# EAGLE design flea (EAGLE 9.6.2)
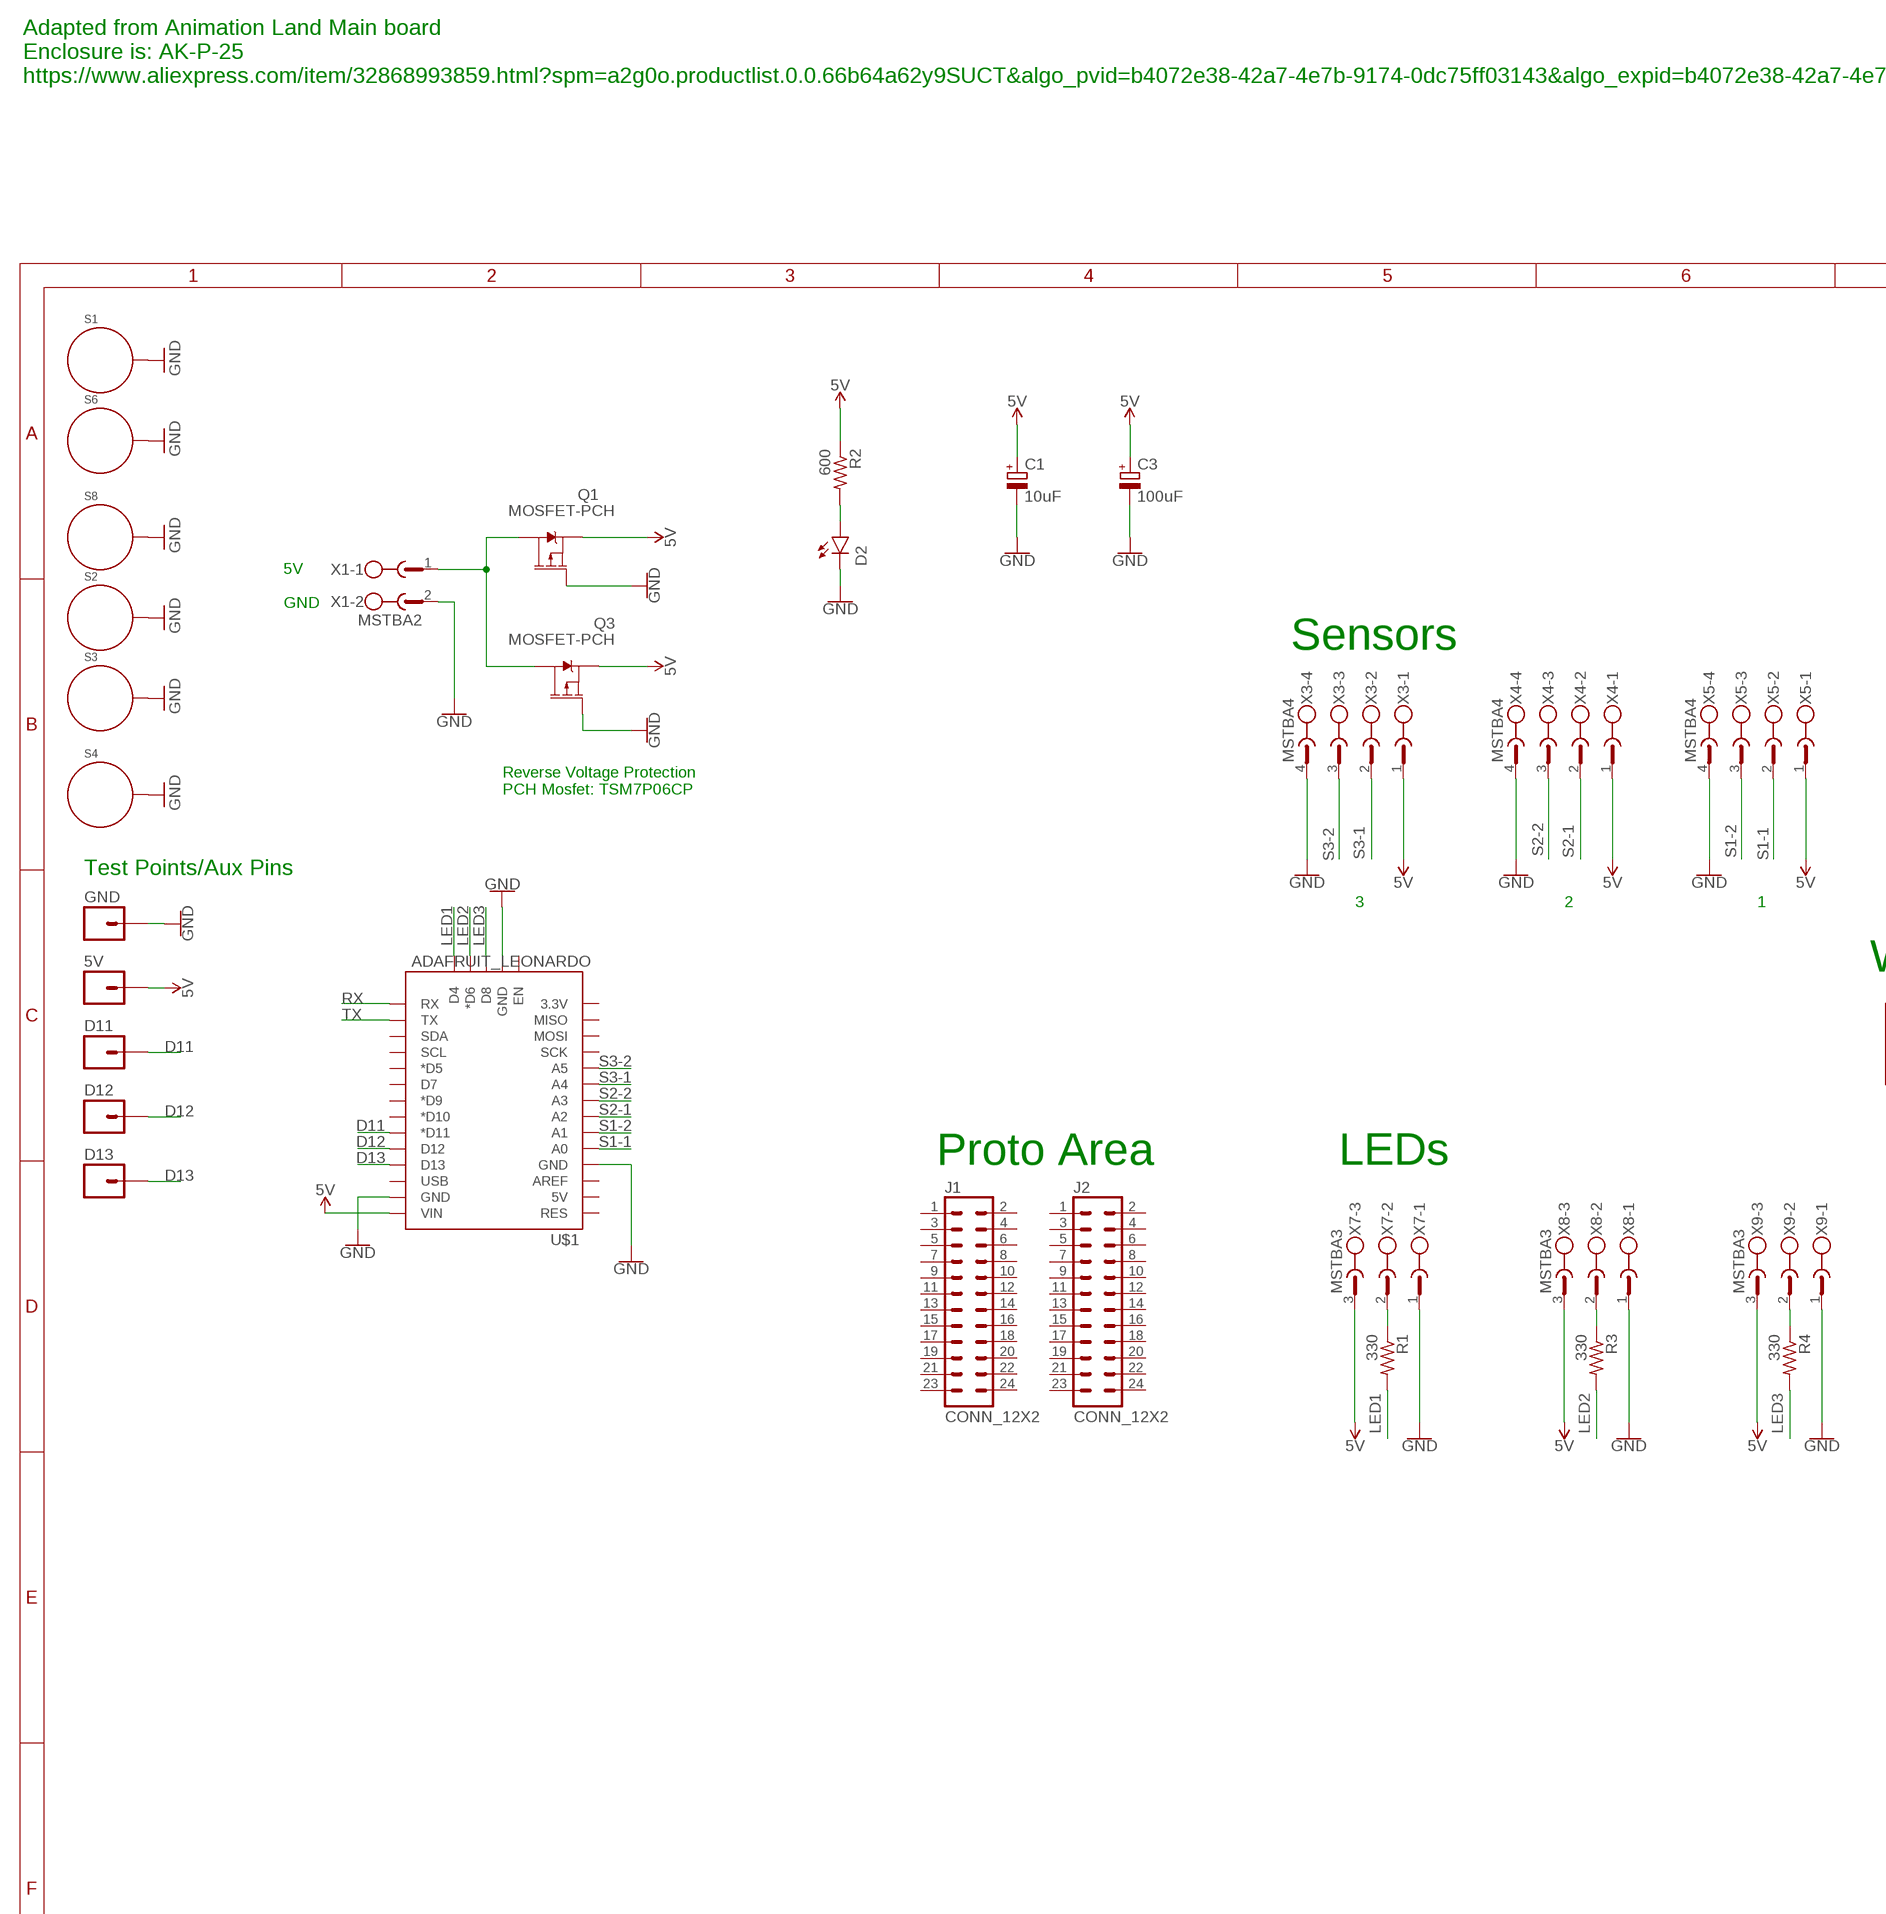
[diagram p0: schematic, sheet 1, part 1 of 2]
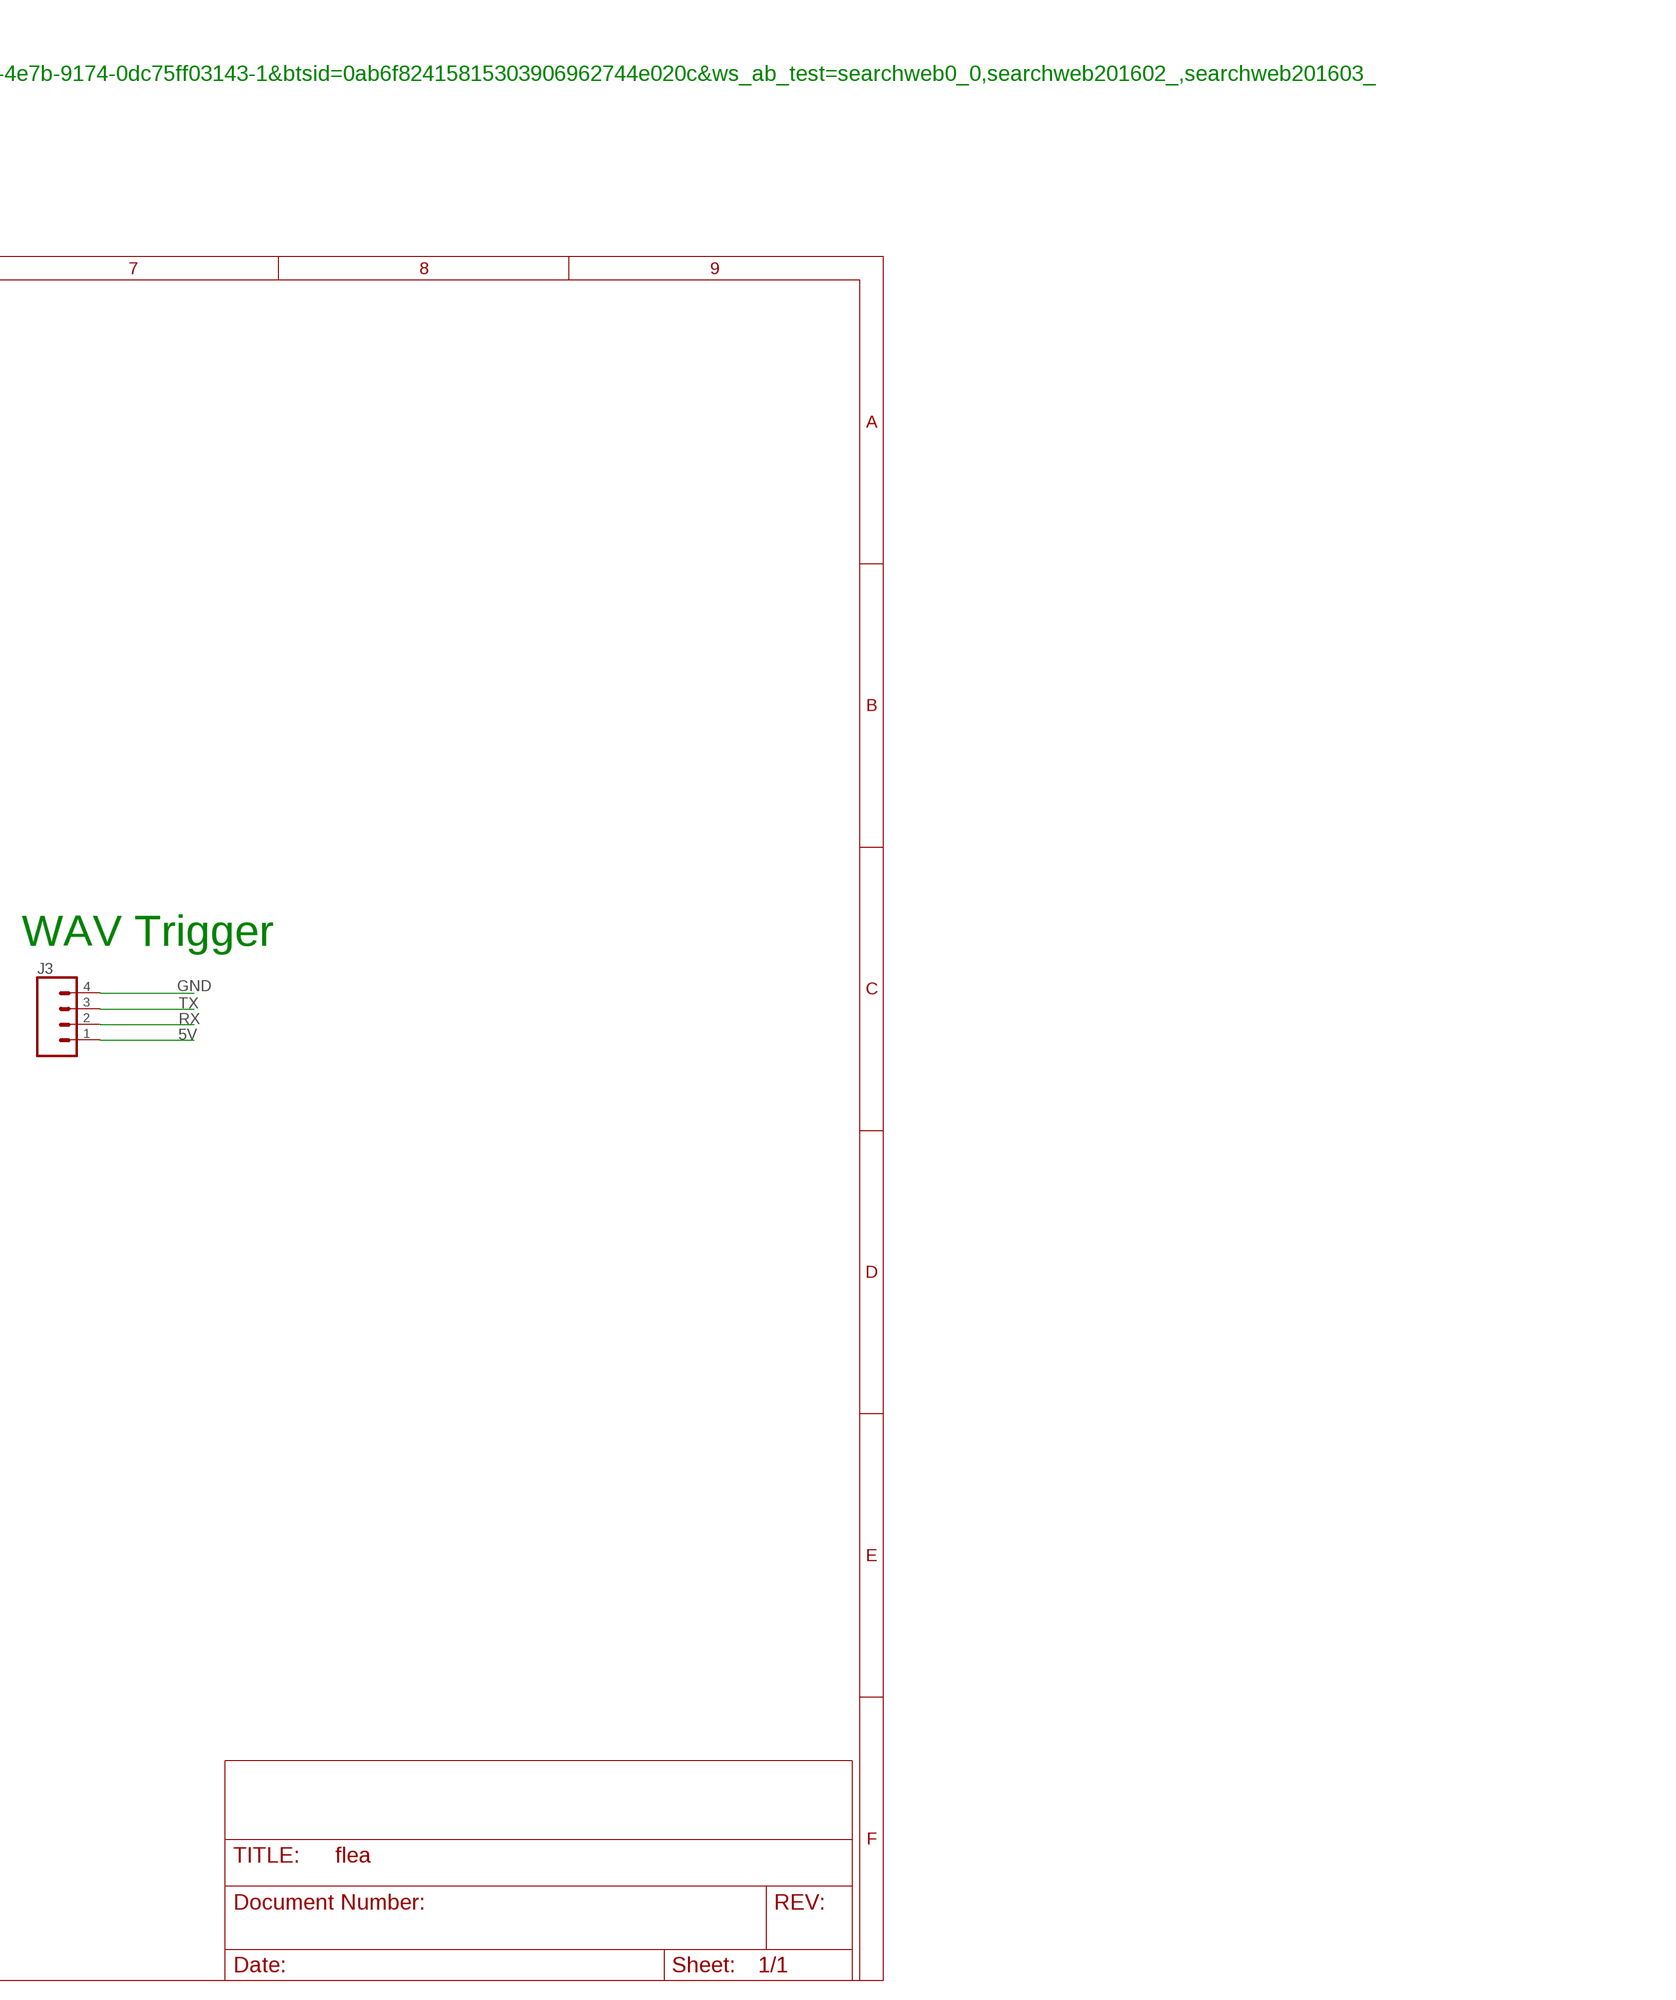
[diagram p1: schematic, sheet 1, part 2 of 2]

## Parts
5V  M01PTH  [1X01]
C1  10uF  CPOL-EUE2-5  [E2-5]
C3  100uF  CPOL-EUE3.5-10  [E3,5-10]
D2  RED  SPARKFUN-LED_LED1206  [SPARKFUN-LED_LED-1206]
D11  M01PTH  [1X01]
D12  M01PTH  [1X01]
D13  M01PTH  [1X01]
GND  M01PTH  [1X01]
J1  CONN_12X2  [2X12]
J2  CONN_12X2  [2X12]
J3  CONN_043.5MM_RA  [1X04_3.5MM_RA]
Q1  MOSFET-PCH  [DPAK]
Q3  MOSFET-PCH  [DPAK]
R1  330  R-US_R0805  [R0805]
R2  600  R-US_R0805  [R0805]
R3  330  R-US_R0805  [R0805]
R4  330  R-US_R0805  [R0805]
S1  STANDOFF_ELECTRICAL5-32  [STANDOFF_ELECTRICAL_5_32]
S2  STANDOFF_ELECTRICAL5-32  [STANDOFF_ELECTRICAL_5_32]
S3  STANDOFF_ELECTRICAL5-32  [STANDOFF_ELECTRICAL_5_32]
S4  STANDOFF_ELECTRICAL5-32  [STANDOFF_ELECTRICAL_5_32]
S6  STANDOFF_ELECTRICAL5-32  [STANDOFF_ELECTRICAL_5_32]
S8  STANDOFF_ELECTRICAL5-32  [STANDOFF_ELECTRICAL_5_32]
U$1  ADAFRUIT_LEONARDO  [ADAFRUIT_LENOARDO]
X1  MSTBA2  [MSTBA2]
X3  MSTBA4  [MSTBA4]
X4  MSTBA4  [MSTBA4]
X5  MSTBA4  [MSTBA4]
X7  MSTBA3  [MSTBA3]
X8  MSTBA3  [MSTBA3]
X9  MSTBA3  [MSTBA3]

## Nets
5V: 5V.1 C1.+ C3.+ J3.1 Q1.3(S) Q3.3(S) R2.1 U$1.VIN X3.1 X4.1 X5.1 X7.3 X8.3 X9.3
D11: D11.1 U$1.D11(*D11)
D12: D12.1 U$1.D12
D13: D13.1 U$1.D13
GND: C1.- C3.- D2.C GND.1 J3.4 Q1.1(G) Q3.1(G) S1.P1 S2.P1 S3.P1 S4.P1 S6.P1 S8.P1 U$1.GND@0(GND) U$1.GND@1(GND) U$1.GND@2(GND) X1.2 X3.4 X4.4 X5.4 X7.1 X8.1 X9.1
LED1: R1.2 U$1.D4
LED2: R3.2 U$1.D6(*D6)
LED3: R4.2 U$1.D8
N$3: D2.A R2.2
N$5: R1.1 X7.2
N$6: R3.1 X8.2
N$7: R4.1 X9.2
N$19: Q1.4(D) Q3.4(D) X1.1
RX: J3.2 U$1.RX
S1-1: U$1.A0 X5.2
S1-2: U$1.A1 X5.3
S2-1: U$1.A2 X4.2
S2-2: U$1.A3 X4.3
S3-1: U$1.A4 X3.2
S3-2: U$1.A5 X3.3
TX: J3.3 U$1.TX
Unconnected: J1.1 J1.2 J1.3 J1.4 J1.5 J1.6 J1.7 J1.8 J1.9 J1.10 J1.11 J1.12 J1.13 J1.14 J1.15 J1.16 J1.17 J1.18 J1.19 J1.20 J1.21 J1.22 J1.23 J1.24 J2.1 J2.2 J2.3 J2.4 J2.5 J2.6 J2.7 J2.8 J2.9 J2.10 J2.11 J2.12 J2.13 J2.14 J2.15 J2.16 J2.17 J2.18 J2.19 J2.20 J2.21 J2.22 J2.23 J2.24 U$1.3V(3.3V) U$1.5V U$1.AREF U$1.D5(*D5) U$1.D7 U$1.D9(*D9) U$1.D10(*D10) U$1.EN U$1.MISO U$1.MOSI U$1.RES U$1.SCK U$1.SCL U$1.SDA U$1.USB

## Notes on the sheet
- Adapted from Animation Land Main board
  Enclosure is: AK-P-25
  https://www.aliexpress.com/item/32868993859.html?spm=a2g0o.productlist.0.0.66b64a62y9SUCT&algo_pvid=b4072e38-42a7-4e7b-9174-0dc75ff03143&algo_expid=b4072e38-42a7-4e7b-9174-0dc75ff03143-1&btsid=0ab6f82415815303906962744e020c&ws_ab_test=searchweb0_0,searchweb201602_,searchweb201603_
- 5V
  
  GND
- Sensors
- Reverse Voltage Protection
  PCH Mosfet: TSM7P06CP
- Test Points/Aux Pins
- 3 | 2 | 1
- WAV Trigger
- Proto Area | LEDs

## Library data of the parts
5V D11-D13 GND = SparkFun-Connectors:M01: Header 1 Standard 1-pin 0.1" header. Use with straight break away headers (SKU : PRT-00116), right angle break away headers (PRT-00553), swiss pins (PRT-00743), machine pins (PRT-00117), and female headers (PRT-00115). SMTSO-256-ET is a "flush mount" nut for a 4-40 screw. The older package used to be too tight, and did not allow it to sit properly thru the drill hit. The latest (0.165DIA) fits nice and snug.
C1 C3 = rcl:CPOL-EU: POLARIZED CAPACITOR, European symbol; SPICEPREFIX: C
D2 = th_libraries:SPARKFUN-LED_LED: LED (Generic) Standard schematic elements and footprints for 5mm, 3mm, 1206, and 0603 sized LEDs. Generic LEDs with no color specified.
J1 J2 = SparkFun-Connectors:CONN_12X2: Multi connection point. Often used as Generic Header-pin footprint for 0.1 inch spaced/style header connections On any of the 0.1 inch spaced packages, you can populate with these: Break Away Headers - Straight <https://www.sparkfun.com/products/116> (PRT-00116) Break Away Male Headers - Right Angle <https://www.sparkfun.com/products/553> (PRT-00553) Female Headers <https://www.sparkfun.com/products/115> (PRT-00115) Break Away Headers - Machine Pin <https://www.sparkfun.com/products/117> (PRT-00117) Break Away Female Headers - Swiss Machine Pin <https://www.sparkfun.com/products/743> (PRT-00743)
J3 = th_libraries:CONN_04: Multi connection point. Often used as Generic Header-pin footprint for 0.1 inch spaced/style header connections On any of the 0.1 inch spaced packages, you can populate with these: Break Away Headers - Straight <https://www.sparkfun.com/products/116> (PRT-00116) Break Away Male Headers - Right Angle <https://www.sparkfun.com/products/553> (PRT-00553) Female Headers <https://www.sparkfun.com/products/115> (PRT-00115) Break Away Headers - Machine Pin <https://www.sparkfun.com/products/117> (PRT-00117) Break Away Female Headers - Swiss Machine Pin <https://www.sparkfun.com/products/743> (PRT-00743) For SCREWTERMINALS and SPRING TERMINALS visit here: Screw Terimnals on SparkFun.com <https://www.sparkfun.com/search/results?term=Screw+Terminals> (5mm/3.5mm/2.54mm spacing) This device is also useful as a general connection point to wire up your design to another part of your project. Our various solder wires solder well into these plated through hole pads. Hook-Up Wire - Assortment (Stranded, 22 AWG) <https://www.sparkfun.com/products/11375> (PRT-11375) Hook-Up Wire - Assortment (Solid Core, 22 AWG) <https://www.sparkfun.com/products/11367> (PRT-11367) View the entire wire category on our website here <https://www.sparkfun.com/categories/141> Special notes: Molex polarized connector foot print use with SKU : PRT-08231 with associated crimp pins and housings. 1MM SMD Version SKU: PRT-10208
Q1 Q3 = th_libraries:MOSFET-PCH: MOSFET-PCH
R1-R4 = rcl:R-US_: RESISTOR, American symbol; SPICEPREFIX: R
S1-S4 S6 S8 = th_libraries:STANDOFF_ELECTRICAL: A standoff intended to be an electrically connected point. Pad size and stop size allow for a #8 Phillips pan screw head to make a solid connection to the board. Added 144mill drill hole that fits my normal wood screw
U$1 = th_libraries:ADAFRUIT_LEONARDO: Adafruit ItsyBitsy 32u4 - 5V 16MHz https://www.adafruit.com/product/3677
X1 = th_libraries:MSTBA2: PHOENIX; MF: FARNELL; MPN: 1757242; OC_FARNELL: 3705171; OC_NEWARK: 71C4161
X3-X5 = th_libraries:MSTBA4: PHOENIX; MF: FARNELL; MPN: 1757268; OC_FARNELL: 3705195; OC_NEWARK: 71C4163
X7-X9 = th_libraries:MSTBA3: PHOENIX; MF: FARNELL; MPN: 1757255; OC_FARNELL: 3705183; OC_NEWARK: 71C4162

## Board
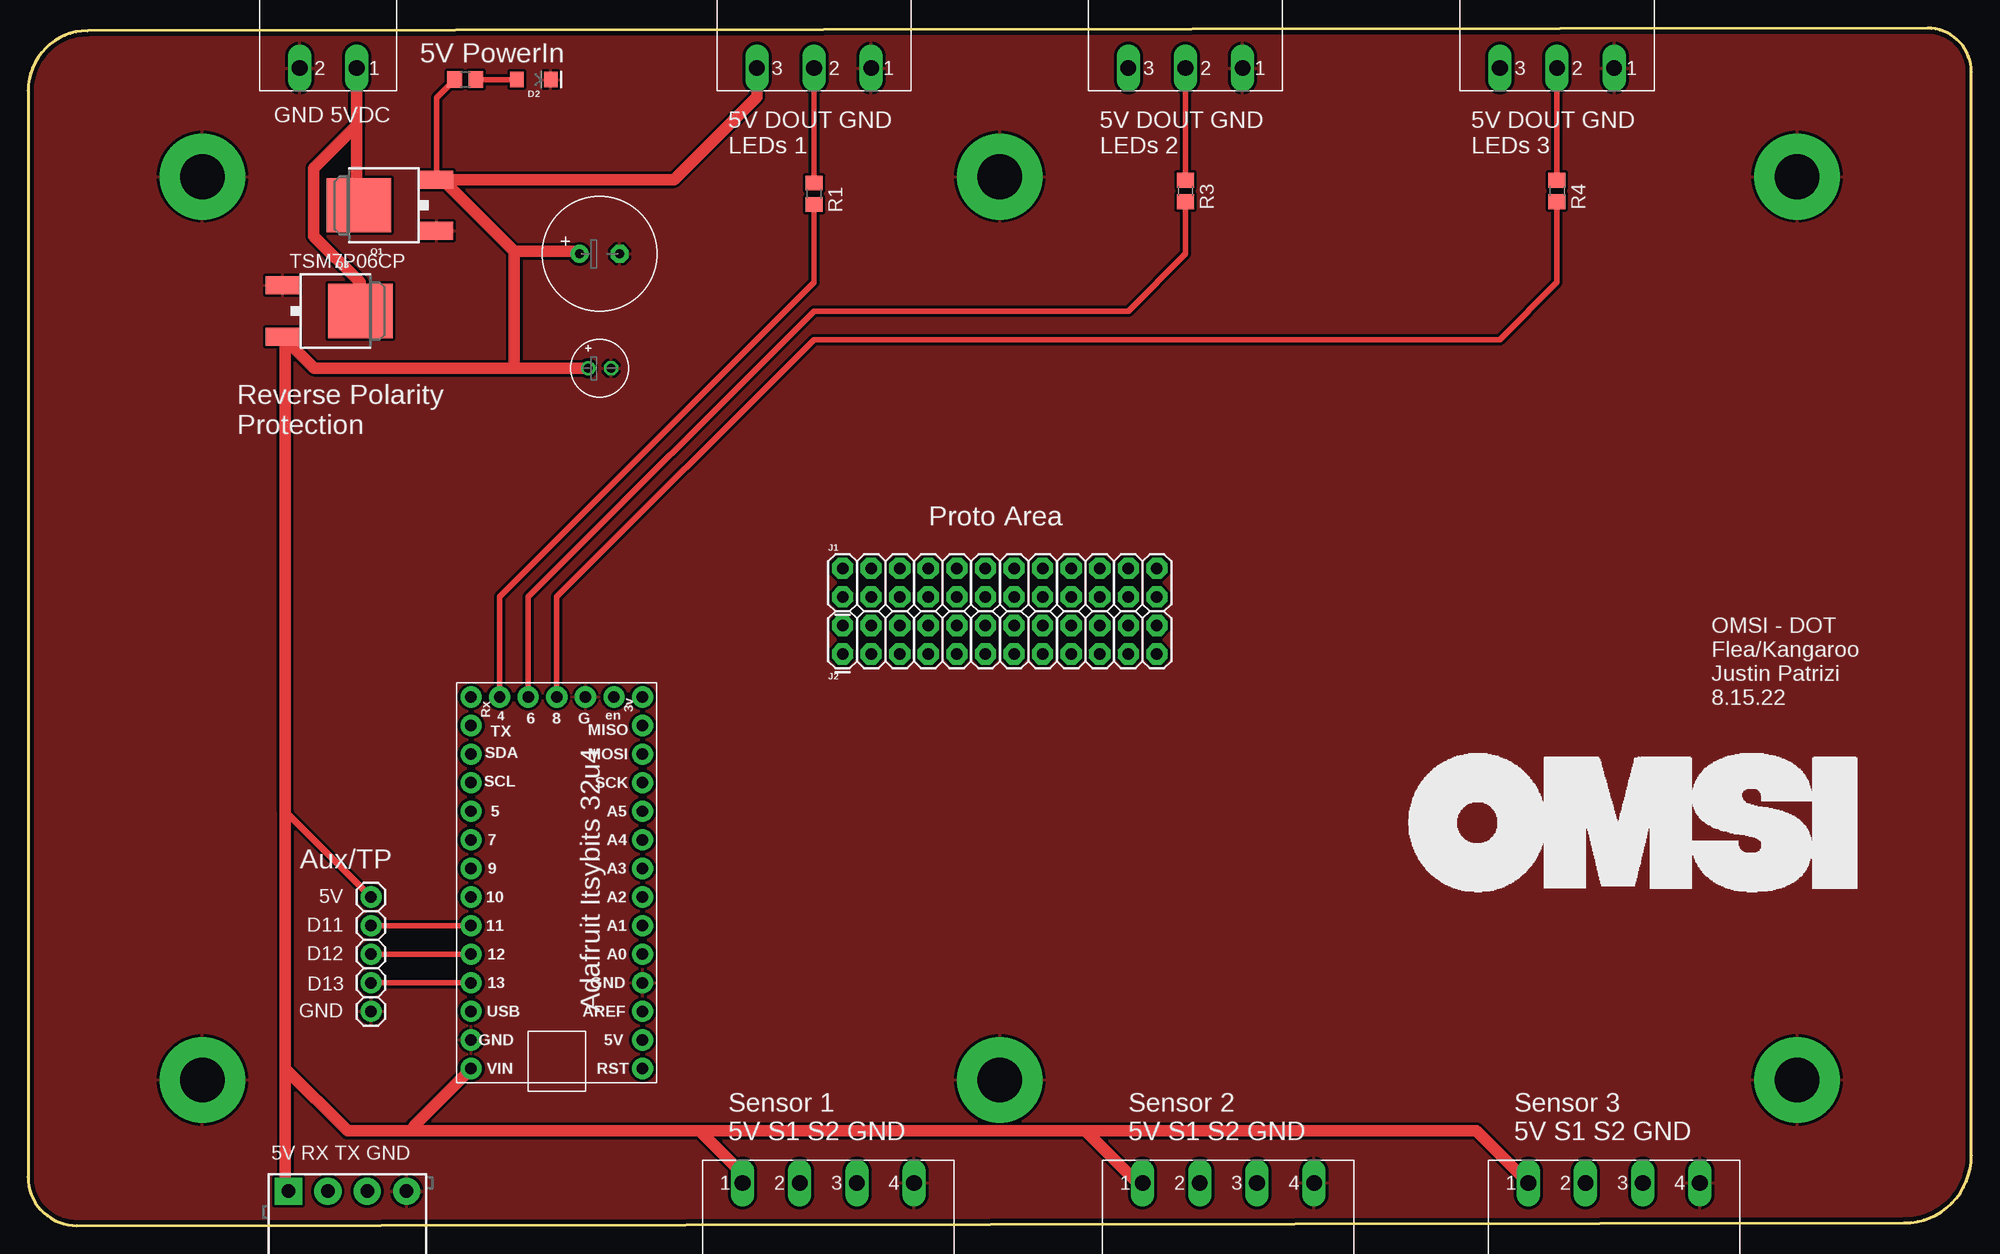
[diagram p2: board, top side]
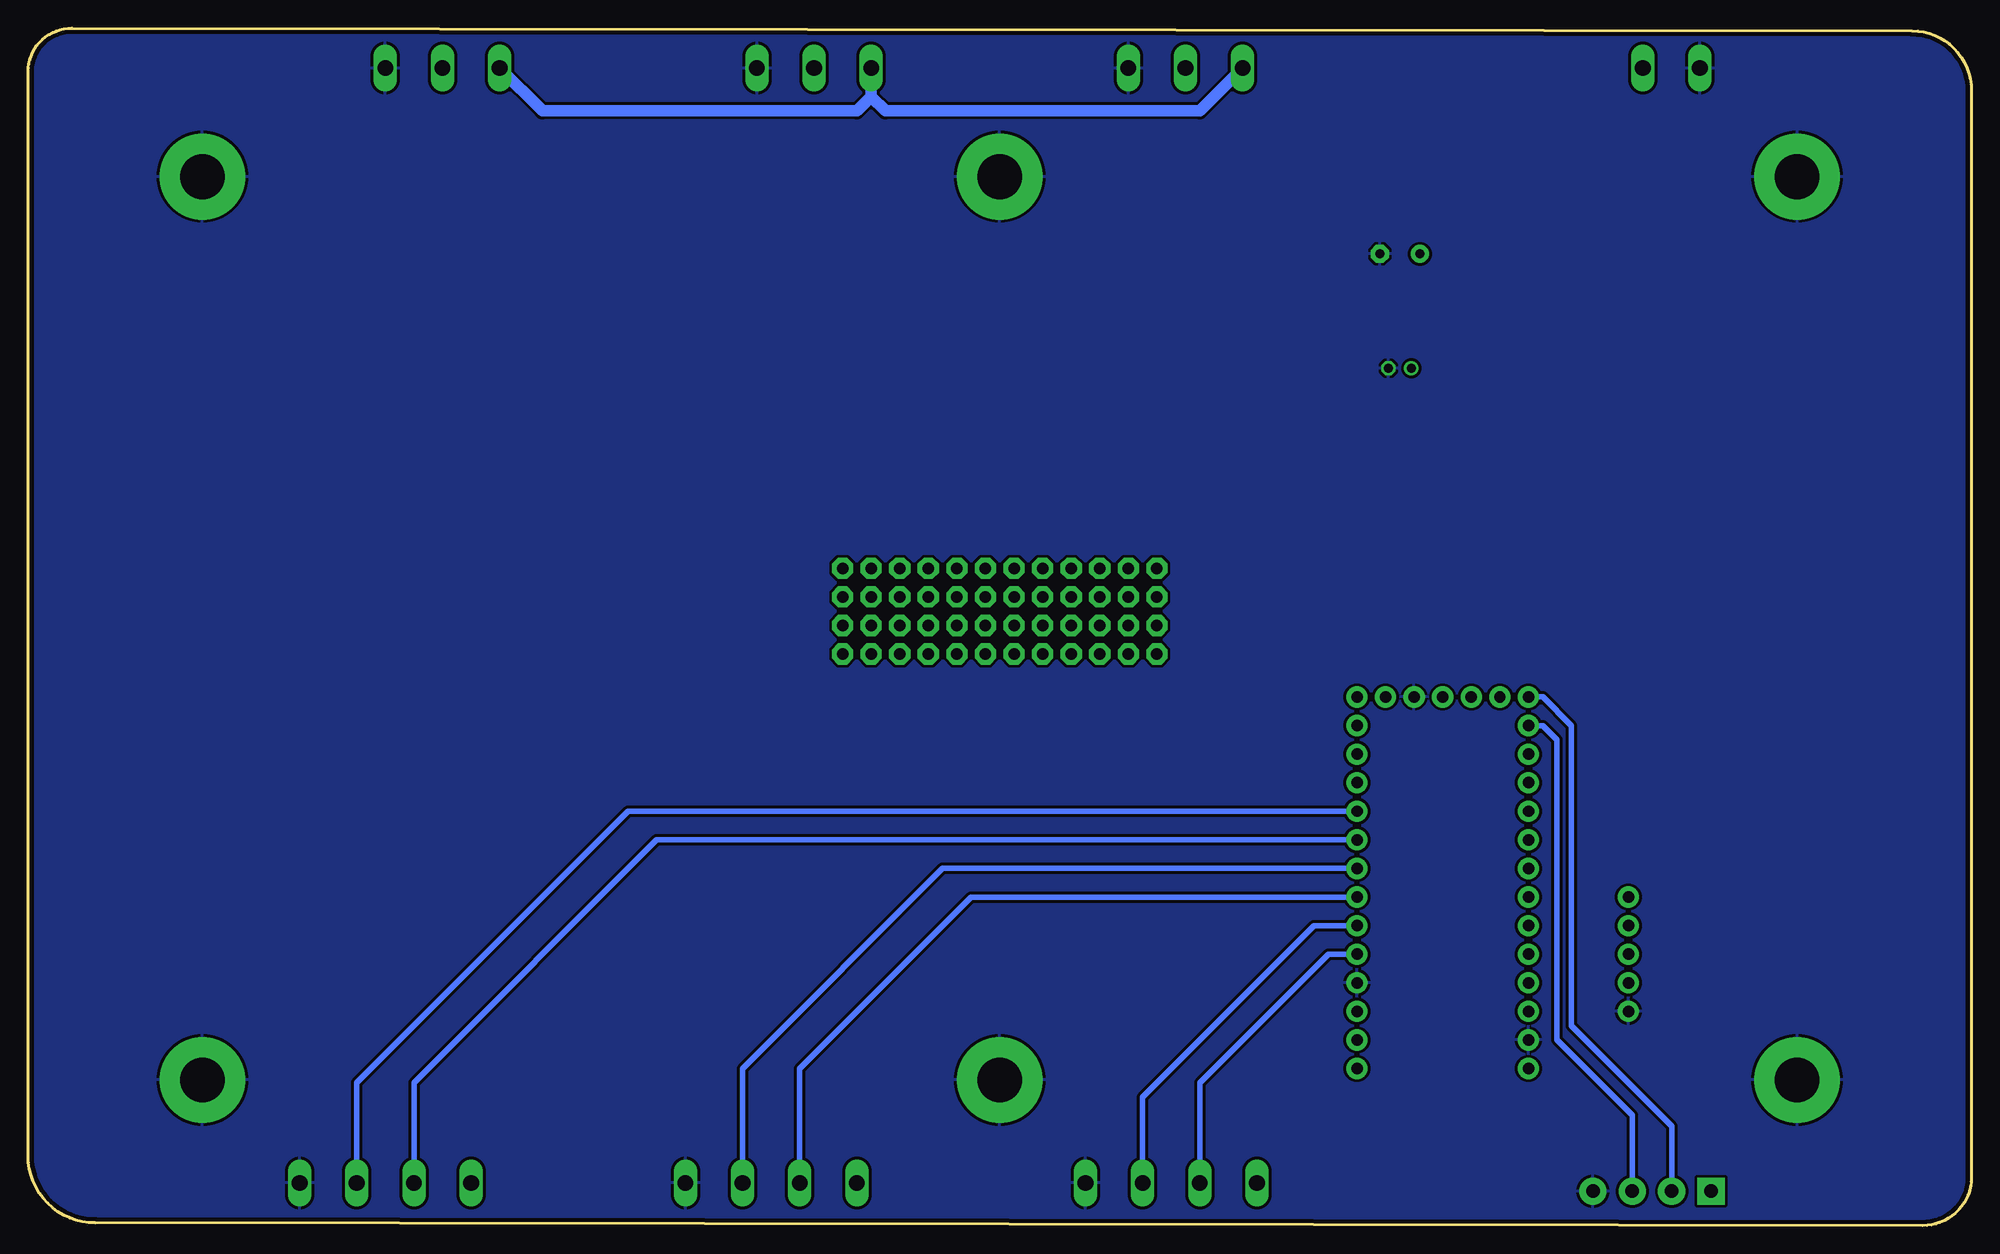
[diagram p3: board, bottom side, seen from below]

Size 172.72 x 106.41 mm. Coordinates in mm from the lower left corner, seen from the top.
Outline: 168.83,106.41 5.28,106.17 arc90 0,100.89 0,4.33 arc90 4.33,0 166.75,0.24 arc90 172.72,6.22 172.72,102.53 arc90 168.83,106.41
Copper layers (1*16): Top 0.035559375mm / dielectric 1.6mm / Bottom 0.035559375mm
Design rules "oshpark-2layer (1) *": minimum track width 10mil, minimum drill 10mil, track to track 8mil, track to pad 8mil, pad to pad 8mil, via to via 8mil, smd to smd 8mil, copper to edge 15mil, drill to drill 6mil, minimum pad ring 5mil, minimum via ring 5mil, stop-mask expansion 2.5mil, vias tented up to drill 25mil, thermal gap 10mil

### Footprints (pad centres in the part's own frame; a part is rotated, then mirrored left to right if it is on the bottom)
1X01 = drill 1.016 pad 1.88: 1 0,0
E2-5 = drill 0.813 pad 1.27: + -1.016,0 | drill 0.813 pad 1.27 octagon: - 1.016,0
E3,5-10 = drill 0.813 pad 1.6: + -1.778,0 | drill 0.813 pad 1.6 octagon: - 1.778,0
SPARKFUN-LED_LED-1206 = smd 1.2 x 1.4: A -1.5,0; C 1.5,0
2X12 = drill 1.016 pad 1.88 octagon: 1 0,0; 2 0,2.54; 3 2.54,0; 4 2.54,2.54; 5 5.08,0; 6 5.08,2.54; 7 7.62,0; 8 7.62,2.54; 9 10.16,0; 10 10.16,2.54; 11 12.7,0; 12 12.7,2.54; 13 15.24,0; 14 15.24,2.54; 15 17.78,0; 16 17.78,2.54; 17 20.32,0; 18 20.32,2.54; 19 22.86,0; 20 22.86,2.54; 21 25.4,0; 22 25.4,2.54; 23 27.94,0; 24 27.94,2.54
1X04_3.5MM_RA = drill 1.2 pad 2.413 square: 1 -0.228,0.023 | drill 1.2 pad 2.413: 2 3.272,0.023; 3 6.772,0.023; 4 10.272,0.023
DPAK = smd 1.6 x 3: 1 -2.28,-5.31; 3 2.28,-5.31 | smd 4.826 x 5.715: 4 0,1.588
R0805 = smd 1.3 x 1.5: 1 -0.95,0; 2 0.95,0
STANDOFF_ELECTRICAL_5_32 = drill 3.969 pad 7.62: P1 0,0
ADAFRUIT_LENOARDO = drill 1.016 pad 1.88: 3V -10.16,-21.59; 5V -10.16,8.89; A0 -10.16,1.27; A1 -10.16,-1.27; A2 -10.16,-3.81; A3 -10.16,-6.35; A4 -10.16,-8.89; A5 -10.16,-11.43; AREF -10.16,6.35; D4 2.54,-21.59; D5 5.08,-11.43; D6 0,-21.59; D7 5.08,-8.89; D8 -2.54,-21.59; D9 5.08,-6.35; D10 5.08,-3.81; D11 5.08,-1.27; D12 5.08,1.27; D13 5.08,3.81; EN -7.62,-21.59; GND@0 -10.16,3.81; GND@1 -5.08,-21.59; GND@2 5.08,8.89; MISO -10.16,-19.05; MOSI -10.16,-16.51; RES -10.16,11.43; RX 5.08,-21.59; SCK -10.16,-13.97; SCL 5.08,-13.97; SDA 5.08,-16.51; TX 5.08,-19.05; USB 5.08,6.35; VIN 5.08,11.43
MSTBA2 = drill 1.397 long: 1 -2.54,5.08; 2 2.54,5.08
MSTBA4 = drill 1.397 long: 1 -7.62,5.08; 2 -2.54,5.08; 3 2.54,5.08; 4 7.62,5.08
MSTBA3 = drill 1.397 long: 1 -5.08,5.08; 2 0,5.08; 3 5.08,5.08

### Placement (x,y rotation side)
5V  30.48,29.2 180 top
C1  50.8,76.19 0 top
C3  50.8,86.35 0 top
D2  44.96,101.85 0 top
D11  30.48,26.66 180 top
D12  30.48,24.12 180 top
D13  30.48,21.58 0 top
GND  30.48,19.04 180 top
J1  72.39,55.87 0 top
J2  72.39,50.79 0 top
J3  23.37,3.04 0 top
Q1  30.99,90.67 90 top
Q3  27.94,81.27 270 top
R1  69.85,91.69 270 top
R2  38.86,101.85 0 top
R3  102.87,91.94 270 top
R4  135.89,91.94 270 top
S1  15.49,93.21 0 top
S2  86.36,93.21 0 top
S3  157.23,12.95 0 top
S4  157.23,93.21 0 top
S6  86.36,12.95 0 top
S8  15.49,12.95 0 top
U$1  44.45,25.39 180 top
X1  26.67,107.94 180 top
X3  140.97,-1.28 0 top
X4  106.68,-1.28 0 top
X5  71.12,-1.28 0 top
X7  69.85,107.94 180 top
X8  102.87,107.94 180 top
X9  135.89,107.94 180 top

### Tracks (layer width: path | path; a pad name or v marks a point on that pad's centre or on a via)
5V
  Top 0.508: Q1.3 36.3,100.23 R2.1 | 22.86,78.76 Q3.3
  Top 0.61: 5V.1 22.86,36.82
  Top 1.016: Q1.3 36.83,92.95 | 36.83,92.95 57.4,92.95 64.77,100.32 X7.3 | 36.83,92.95 43.18,86.6 | 43.18,86.6 48.77,86.6 C3.+ | Q3.3 25.43,76.19 43.18,76.19 | 43.18,76.19 C1.+ | 43.18,86.6 43.18,76.19 | 22.86,13.96 22.86,36.82 22.86,78.76 | 59.69,8.43 93.98,8.43 | 93.98,8.43 128.73,8.43 X3.1 | 22.86,13.96 28.4,8.43 34.29,8.43 | 34.29,8.43 59.69,8.43 | X4.1 98.6,3.8 93.98,8.43 | 59.69,8.43 63.5,4.62 X5.1 | 22.86,13.96 22.86,3.34 J3.1 | U$1.VIN 34.29,8.88 34.29,8.43
  Bottom 1.016: X7.3 68.58,99.05 96.52,99.05 97.79,100.32 | 97.79,100.32 X8.3 | 97.79,100.32 99.06,99.05 127,99.05 X9.3
D11
  Top 0.508: U$1.D11 D11.1
D12
  Top 0.508: U$1.D12 D12.1
D13
  Top 0.508: U$1.D13 D13.1
GND
  pour Top (isolate 0.254): 0,107.94 173.25,107.94 173.25,1.79 170.18,-1.28 3.59,-1.28 arc-45 1.8,-0.53 0,1.26
  pour Bottom (isolate 0.254): 2.01,107.42 174.52,107.42 174.52,4.33 168.91,-1.28 4.86,-1.28 arc-45 3.07,-0.53 0,2.53 0,104.35 arc-45 0.74,106.15
LED1
  Top 0.508: R1.2 69.85,83.81 41.91,55.87 U$1.D4
LED2
  Top 0.508: U$1.D6 44.45,55.87 69.85,81.27 97.79,81.27 102.87,86.35 R3.2
LED3
  Top 0.508: U$1.D8 46.99,55.87 69.85,78.73 130.81,78.73 135.89,83.81 R4.2
N$3
  Top 0.508: R2.2 D2.A
N$5
  Top 0.508: R1.1 X7.2
N$6
  Top 0.508: R3.1 X8.2
N$7
  Top 0.508: R4.1 X9.2
N$19
  Top 1.016: 29.21,97.78 29.21,90.16 29.4,90.35 Q1.4 | 29.21,97.78 X1.1 | 29.21,97.78 25.4,93.97 25.4,87.94 29.53,83.81 Q3.4
RX
  Bottom 0.508: J3.2 26.64,8.85 35.56,17.77 35.56,44.44 38.1,46.98 U$1.RX
S1-1
  Bottom 0.508: X5.2 68.58,12.69 57.15,24.12 U$1.A0
S1-2
  Bottom 0.508: X5.3 73.66,11.42 58.42,26.66 U$1.A1
S2-1
  Bottom 0.508: X4.2 104.14,13.96 88.9,29.2 U$1.A2
S2-2
  Bottom 0.508: X4.3 109.22,13.96 91.44,31.74 U$1.A3
S3-1
  Bottom 0.508: X3.2 138.43,12.69 116.84,34.28 U$1.A4
S3-2
  Bottom 0.508: X3.3 143.51,12.69 119.38,36.82 U$1.A5
TX
  Bottom 0.508: J3.3 30.14,9.81 36.83,16.5 36.83,43.17 38.1,44.44 U$1.TX

### Text on the board
tPlace: 5V PowerIn | GND 5VDC | TSM7P06CP | Reverse Polarity / Protection | Proto Area | Adafruit Itsybits 32u4 | 5V RX TX GND
tNames: 5V DOUT GND / LEDs 1 | 5V DOUT GND / LEDs 2 | 5V DOUT GND / LEDs 3 | OMSI - DOT / Flea/Kangaroo / Justin Patrizi / 8.15.22 | Aux/TP | Sensor 1 / 5V S1 S2 GND | Sensor 2 / 5V S1 S2 GND | Sensor 3 / 5V S1 S2 GND